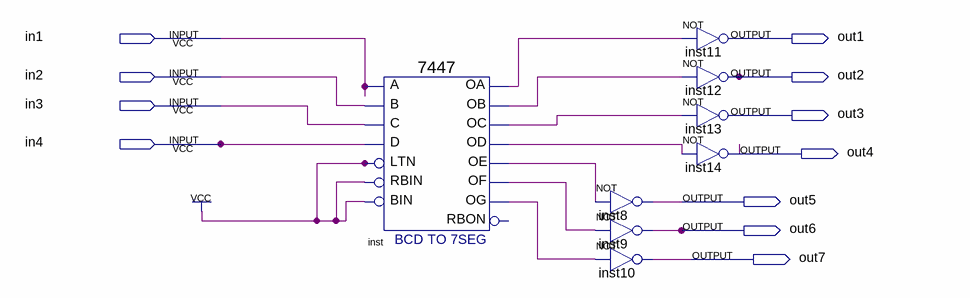
[diagram p0: schematic sheet]
// Quartus schematic Decto7seg.bdf as structural Verilog: 8 symbols, 11 pins
module Decto7seg (
  input  in1,
  input  in2,
  input  in3,
  input  in4,
  output out1,
  output out2,
  output out3,
  output out4,
  output out5,
  output out6,
  output out7
);

  wire inst_oa, inst_ob, inst_oc, inst_od, inst_oe, inst_of, inst_og;

  \7447  inst (
    .LTN(1'b1), .B(in2), .C(in3), .D(in4), .RBIN(1'b1), .BIN(1'b1), .A(in1), .OB(inst_ob), .OC(inst_oc),
    .OE(inst_oe), .OD(inst_od), .OF(inst_of), .OG(inst_og), .OA(inst_oa));  // open: RBON
  not inst8 (out5, inst_oe);
  not inst9 (out6, inst_of);
  not inst10 (out7, inst_og);
  // NOT inst11 has open pins: IN=inst_oa, OUT=open
  not inst12 (out2, inst_ob);
  not inst13 (out3, inst_oc);
  not inst14 (out4, inst_od);
endmodule
